# EAGLE board snesram (EAGLE 5.06), part 1 of 2
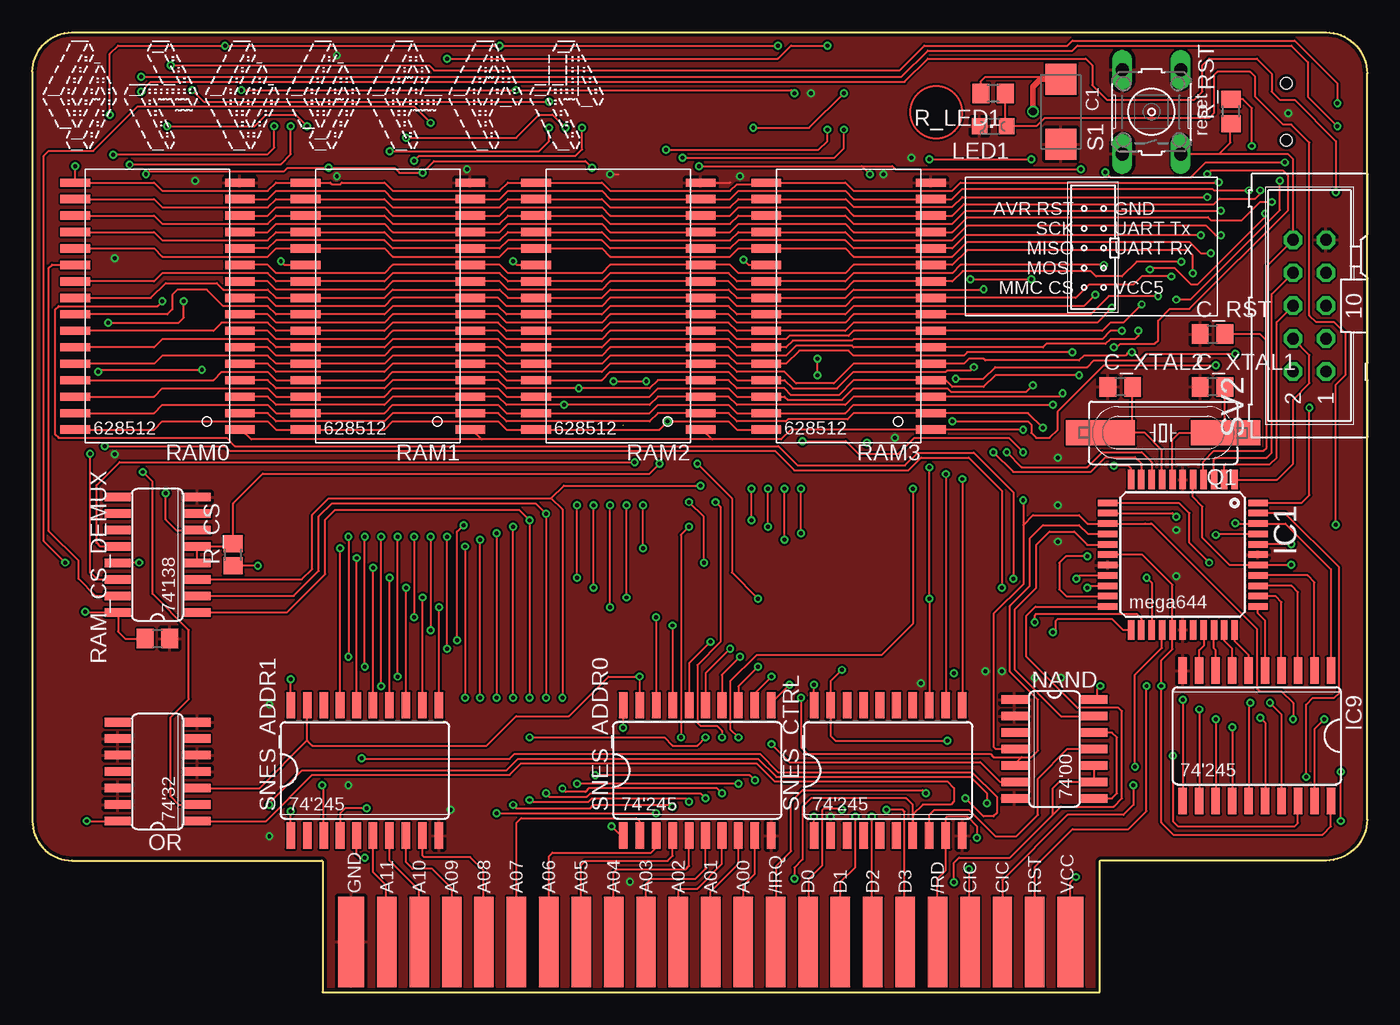
[diagram p2: board, top side]
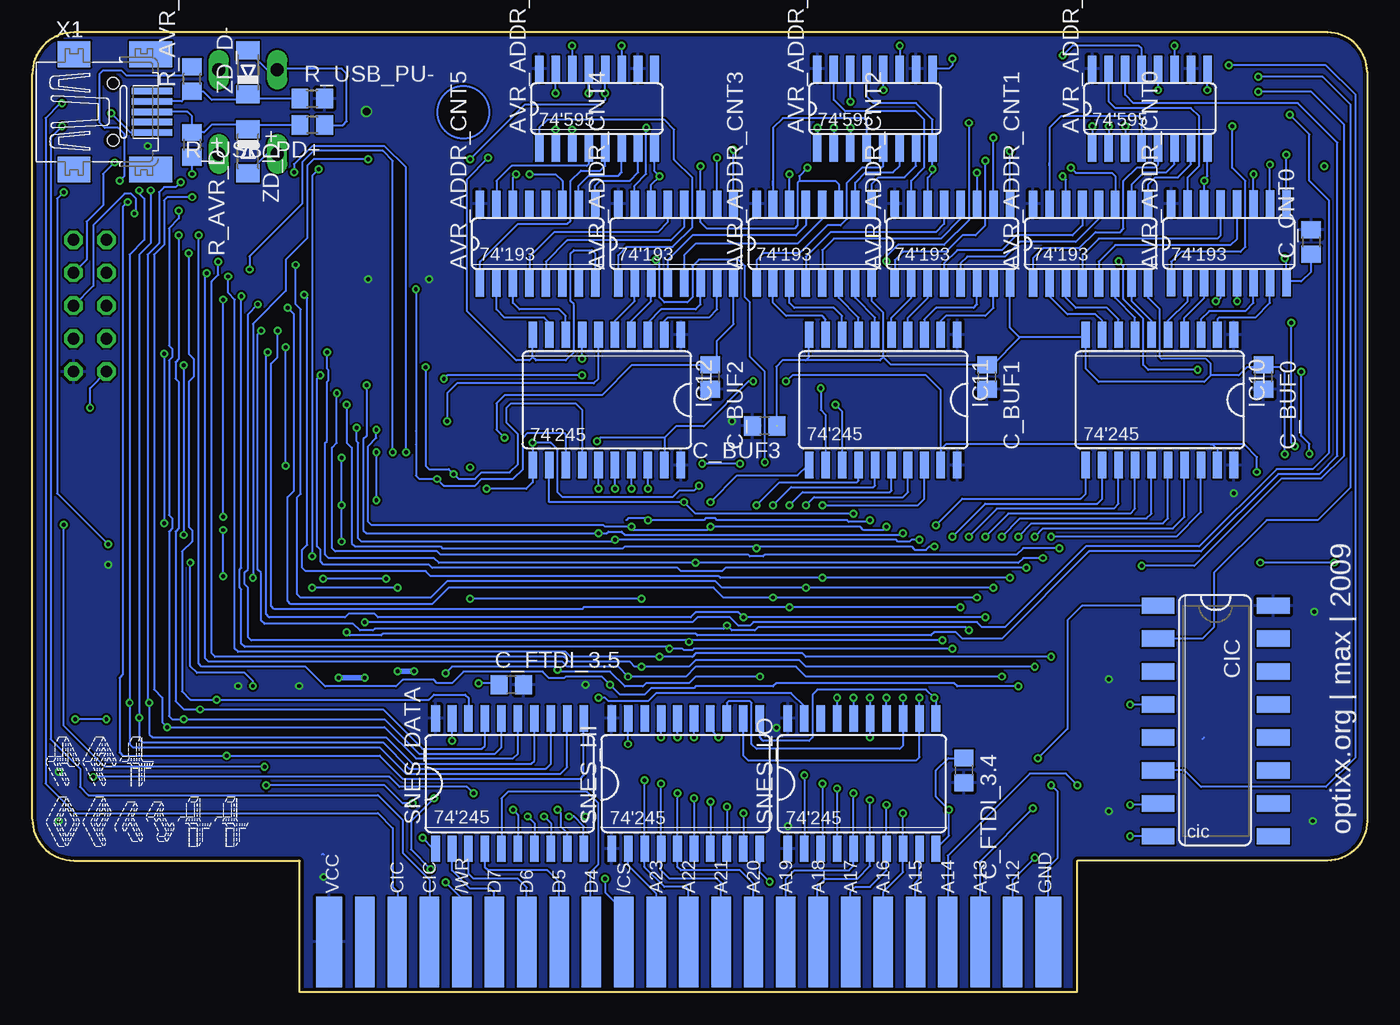
[diagram p3: board, bottom side, seen from below]

Size 103 x 74.04 mm. Coordinates in mm from the lower left corner, seen from the top.
Outline: 103,70.83 103,13.33 arc-90 99.82,10.16 82.42,10.16
Outline: 22.38,10.11 22.38,0 82.36,0 82.36,10.11
Outline: 22.35,10.16 3.05,10.16 arc-90 0,13.21 0,70.99 arc-90 3.05,74.04 99.82,74.04 arc-90 103,70.87
Copper layers (1*16): Top 0.035mm / dielectric 1.5mm / Bottom 0.035mm
Design rules "PropagandaPCB": minimum track width 6mil, minimum drill 10mil, track to track 6mil, track to pad 6mil, pad to pad 6mil, via to via 6mil, smd to smd 6mil, copper to edge 10mil, drill to drill 10mil, minimum pad ring 10mil, minimum via ring 6mil, stop-mask expansion 2mil, vias tented up to drill 100mil, thermal gap 10mil

## Footprints (pad centres in the part's own frame; a part is rotated, then mirrored left to right if it is on the bottom)
SO16 = smd 0.66 x 2.032: 1 -4.445,-3.073; 2 -3.175,-3.073; 3 -1.905,-3.073; 4 -0.635,-3.073; 5 0.635,-3.073; 6 1.905,-3.073; 7 3.175,-3.073; 8 4.445,-3.073; 9 4.445,3.073; 10 3.175,3.073; 11 1.905,3.073; 12 0.635,3.073; 13 -0.635,3.073; 14 -1.905,3.073; 15 -3.175,3.073; 16 -4.445,3.073
SMC_C = smd 2.4 x 2.4: + -2.5,0; - 2.5,0
C0805 = smd 1.3 x 1.5: 1 -0.95,0; 2 0.95,0
DIL16_SMD = smd 1.27 x 2.54: 1 -8.89,-4.445; 2 -6.35,-4.445; 3 -3.81,-4.445; 4 -1.27,-4.445; 5 1.27,-4.445; 6 3.81,-4.445; 7 6.35,-4.445; 8 8.89,-4.445; 9 8.89,4.445; 10 6.35,4.445; 11 3.81,4.445; 12 1.27,4.445; 13 -1.27,4.445; 14 -3.81,4.445; 15 -6.35,4.445; 16 -8.89,4.445
TQFP44 = smd 1.5 x 0.5: 1 -5.8,4; 2 -5.8,3.2; 3 -5.8,2.4; 4 -5.8,1.6; 5 -5.8,0.8; 6 -5.8,0; 7 -5.8,-0.8; 8 -5.8,-1.6; 9 -5.8,-2.4; 10 -5.8,-3.2; 11 -5.8,-4; 23 5.8,-4; 24 5.8,-3.2; 25 5.8,-2.4; 26 5.8,-1.6; 27 5.8,-0.8; 28 5.8,0; 29 5.8,0.8; 30 5.8,1.6; 31 5.8,2.4; 32 5.8,3.2; 33 5.8,4 | smd 0.5 x 1.5: 12 -4,-5.8; 13 -3.2,-5.8; 14 -2.4,-5.8; 15 -1.6,-5.8; 16 -0.8,-5.8; 17 0,-5.8; 18 0.8,-5.8; 19 1.6,-5.8; 20 2.4,-5.8; 21 3.2,-5.8; 22 4,-5.8; 34 4,5.8; 35 3.2,5.8; 36 2.4,5.8; 37 1.6,5.8; 38 0.8,5.8; 39 0,5.8; 40 -0.8,5.8; 41 -1.6,5.8; 42 -2.4,5.8; 43 -3.2,5.8; 44 -4,5.8
SO20W = smd 0.66 x 2.032: 1 -5.715,-5.029; 2 -4.445,-5.029; 3 -3.175,-5.029; 4 -1.905,-5.029; 5 -0.635,-5.029; 6 0.635,-5.029; 7 1.905,-5.029; 8 3.175,-5.029; 9 4.445,-5.029; 10 5.715,-5.029; 11 5.715,5.029; 12 4.445,5.029; 13 3.175,5.029; 14 1.905,5.029; 15 0.635,5.029; 16 -0.635,5.029; 17 -1.905,5.029; 18 -3.175,5.029; 19 -4.445,5.029; 20 -5.715,5.029
CHIPLED_0805 = smd 1.2 x 1.2: A 0,-1.05; C 0,1.05
SO14 = smd 0.66 x 2.032: 1 -3.81,-3.073; 2 -2.54,-3.073; 3 -1.27,-3.073; 4 0,-3.073; 5 1.27,-3.073; 6 2.54,-3.073; 7 3.81,-3.073; 8 3.81,3.073; 9 2.54,3.073; 10 1.27,3.073; 11 0,3.073; 12 -1.27,3.073; 13 -2.54,3.073; 14 -3.81,3.073
HC49UP = smd 5.334 x 1.93: 1 -4.826,0; 2 4.826,0
R0805 = smd 1.3 x 1.5: 1 -0.95,0; 2 0.95,0
R0805' = smd 1.3 x 1.5: 1 -0.85,0; 2 0.85,0
SOP-32 = smd 2.286 x 0.635: 1 -6.35,9.525; 2 -6.35,8.255; 3 -6.35,6.985; 4 -6.35,5.715; 5 -6.35,4.445; 6 -6.35,3.175; 7 -6.35,1.905; 8 -6.35,0.635; 9 -6.35,-0.635; 10 -6.35,-1.905; 11 -6.35,-3.175; 12 -6.35,-4.445; 13 -6.35,-5.715; 14 -6.35,-6.985; 15 -6.35,-8.255; 16 -6.35,-9.525; 17 6.35,-9.525; 18 6.35,-8.255; 19 6.35,-6.985; 20 6.35,-5.715; 21 6.35,-4.445; 22 6.35,-3.175; 23 6.35,-1.905; 24 6.35,-0.635; 25 6.35,0.635; 26 6.35,1.905; 27 6.35,3.175; 28 6.35,4.445; 29 6.35,5.715; 30 6.35,6.985; 31 6.35,8.255; 32 6.35,9.525
B3F-10XX = drill 1.016 long: 1 -3.251,2.261; 2 3.251,2.261; 3 -3.251,-2.261; 4 3.251,-2.261
ML10 = drill 0.914 octagon: 1 -5.08,-1.27; 2 -5.08,1.27; 3 -2.54,-1.27; 4 -2.54,1.27; 5 0,-1.27; 6 0,1.27; 7 2.54,-1.27; 8 2.54,1.27; 9 5.08,-1.27; 10 5.08,1.27
SNES_CON = smd 2 x 7: 5 2.25,3.5; 27 57.75,3.5 | smd 1.5 x 7: 6 5,3.5; 7 7.5,3.5; 8 10,3.5; 9 12.5,3.5; 10 15,3.5; 11 17.5,3.5; 12 20,3.5; 13 22.5,3.5; 14 25,3.5; 15 27.5,3.5; 16 30,3.5; 17 32.5,3.5; 18 35,3.5; 19 37.5,3.5; 20 40,3.5; 21 42.5,3.5; 22 45,3.5; 23 47.5,3.5; 24 50,3.5; 25 52.5,3.5; 26 55,3.5 | smd 2 x 7 bottom: 36 2.25,3.5; 58 57.75,3.5 | smd 1.5 x 7 bottom: 37 5,3.5; 38 7.5,3.5; 39 10,3.5; 40 12.5,3.5; 41 15,3.5; 42 17.5,3.5; 43 20,3.5; 44 22.5,3.5; 45 25,3.5; 46 27.5,3.5; 47 30,3.5; 48 32.5,3.5; 49 35,3.5; 50 37.5,3.5; 51 40,3.5; 52 42.5,3.5; 53 45,3.5; 54 47.5,3.5; 55 50,3.5; 56 52.5,3.5; 57 55,3.5
32005-201 = smd 3.1 x 0.5: 1 3,1.6; 2 3,0.8; 3 3,0; 4 3,-0.8; 5 3,-1.6 | smd 2.5 x 2: M1 -3,-4.45; M2 -3,4.45 | smd 3.3 x 2: M3 2.9,4.45; M4 2.9,-4.45 | hole 0.9: 0,2.2; 0,-2.2
MINIMELF = smd 1.4 x 1.8: A 1.7,0; C -1.7,0

## Placement (x,y rotation side)
AVR_ADDR_CNT0  40193D  [SO16]  10.67,57.77 0 bottom
AVR_ADDR_CNT1  40193D  [SO16]  21.34,57.75 0 bottom
AVR_ADDR_CNT2  40193D  [SO16]  32,57.75 0 bottom
AVR_ADDR_CNT3  40193D  [SO16]  42.67,57.75 0 bottom
AVR_ADDR_CNT4  40193D  [SO16]  53.34,57.75 0 bottom
AVR_ADDR_CNT5  40193D  [SO16]  64.01,57.75 0 bottom
AVR_ADDR_SREG0  74HCT595D  [SO16]  16.76,68.17 0 bottom
AVR_ADDR_SREG1  74HCT595D  [SO16]  37.97,68.17 0 bottom
AVR_ADDR_SREG2  74HCT595D  [SO16]  59.44,68.17 0 bottom
C1  [SMC_C]  79.38,67.91 270 top
C_BUF0  100n  [C0805]  8,47.47 270 bottom
C_BUF1  100n  [C0805]  29.34,47.47 270 bottom
C_BUF2  100n  [C0805]  50.67,47.47 270 bottom
C_BUF3  100n  [C0805]  46.48,43.69 180 bottom
C_CNT0  100n  [C0805]  4.32,57.88 90 bottom
C_DEMUX  100n  [C0805]  9.65,27.27 180 top
C_FTDI_3.4  100n  [C0805]  31.11,17.11 270 bottom
C_FTDI_3.5  100n  [C0805]  66.04,23.72 0 bottom
C_RST  47n  [C0805]  91.06,50.77 0 top
C_XTAL1  22p  [C0805]  91.06,46.7 0 top
C_XTAL2  22p  [C0805]  83.95,46.7 0 top
CIC  DIL16_SMD  [DIL16_SMD]  11.68,20.92 270 bottom
IC1  ATMEGA644A  [TQFP44]  88.77,33.75 270 top
IC9  74LS245DW  [SO20W]  94.49,19.78 180 top
IC10  74LS245DW  [SO20W]  16,45.69 180 bottom
IC11  74LS245DW  [SO20W]  37.34,45.69 180 bottom
IC12  74LS245DW  [SO20W]  58.67,45.69 180 bottom
LED1  2-4mA  [CHIPLED_0805]  74.14,66.8 90 top
NAND  74S00D  [SO14]  78.87,18.76 270 top
OR  74HC32D  [SO14]  9.65,17.02 90 top
Q1  20MHz  [HC49UP]  87.25,43.15 180 top
R_AVR_D+  68  [R0805]  90.68,65.37 270 bottom
R_AVR_D-  68  [R0805]  90.68,70.45 90 bottom
R_CS  200  [R0805']  15.49,33.75 90 top
R_LED1  1k6  [R0805]  74.14,69.34 180 top
R_RST  4k7  [R0805]  92.49,67.94 90 top
R_USB_PD+  1M  [R0805]  81.41,66.9 180 bottom
R_USB_PU-  1k5  [R0805]  81.41,68.93 0 bottom
RAM0  KM628512-XX  [SOP-32]  9.65,52.93 180 top
RAM1  KM628512-XX  [SOP-32]  27.43,52.93 180 top
RAM2  KM628512-XX  [SOP-32]  45.21,52.93 180 top
RAM3  KM628512-XX  [SOP-32]  62.99,52.93 180 top
RAM_CS_DEMUX  74LS138D  [SO16]  9.65,33.75 90 top
S1  [B3F-10XX]  86.36,67.91 90 top
SNES_ADDR0  74LS245DW  [SO20W]  51.31,17.11 0 top
SNES_ADDR1  74LS245DW  [SO20W]  25.65,17.11 0 top
SNES_CTRL  74LS245DW  [SO20W]  66.04,17.11 0 top
SNES_DATA  74LS245DW  [SO20W]  66.17,16.1 0 bottom
SNES_HI  74LS245DW  [SO20W]  52.58,16.1 0 bottom
SNES_LO  74LS245DW  [SO20W]  38.99,16.1 0 bottom
SV2  [ML10]  98.55,52.96 90 top
U$3  SNES_CON_FRONT  [SNES_CON]  22.35,0.38 0 top
X1  MINI-USB  [32005-201]  96.77,67.91 0 bottom
ZD_D+  3.6V  [MINIMELF]  86.36,64.86 270 bottom
ZD_D-  3.6V  [MINIMELF]  86.36,70.96 90 bottom